# Altium project Audio Amplifier.PrjPcb
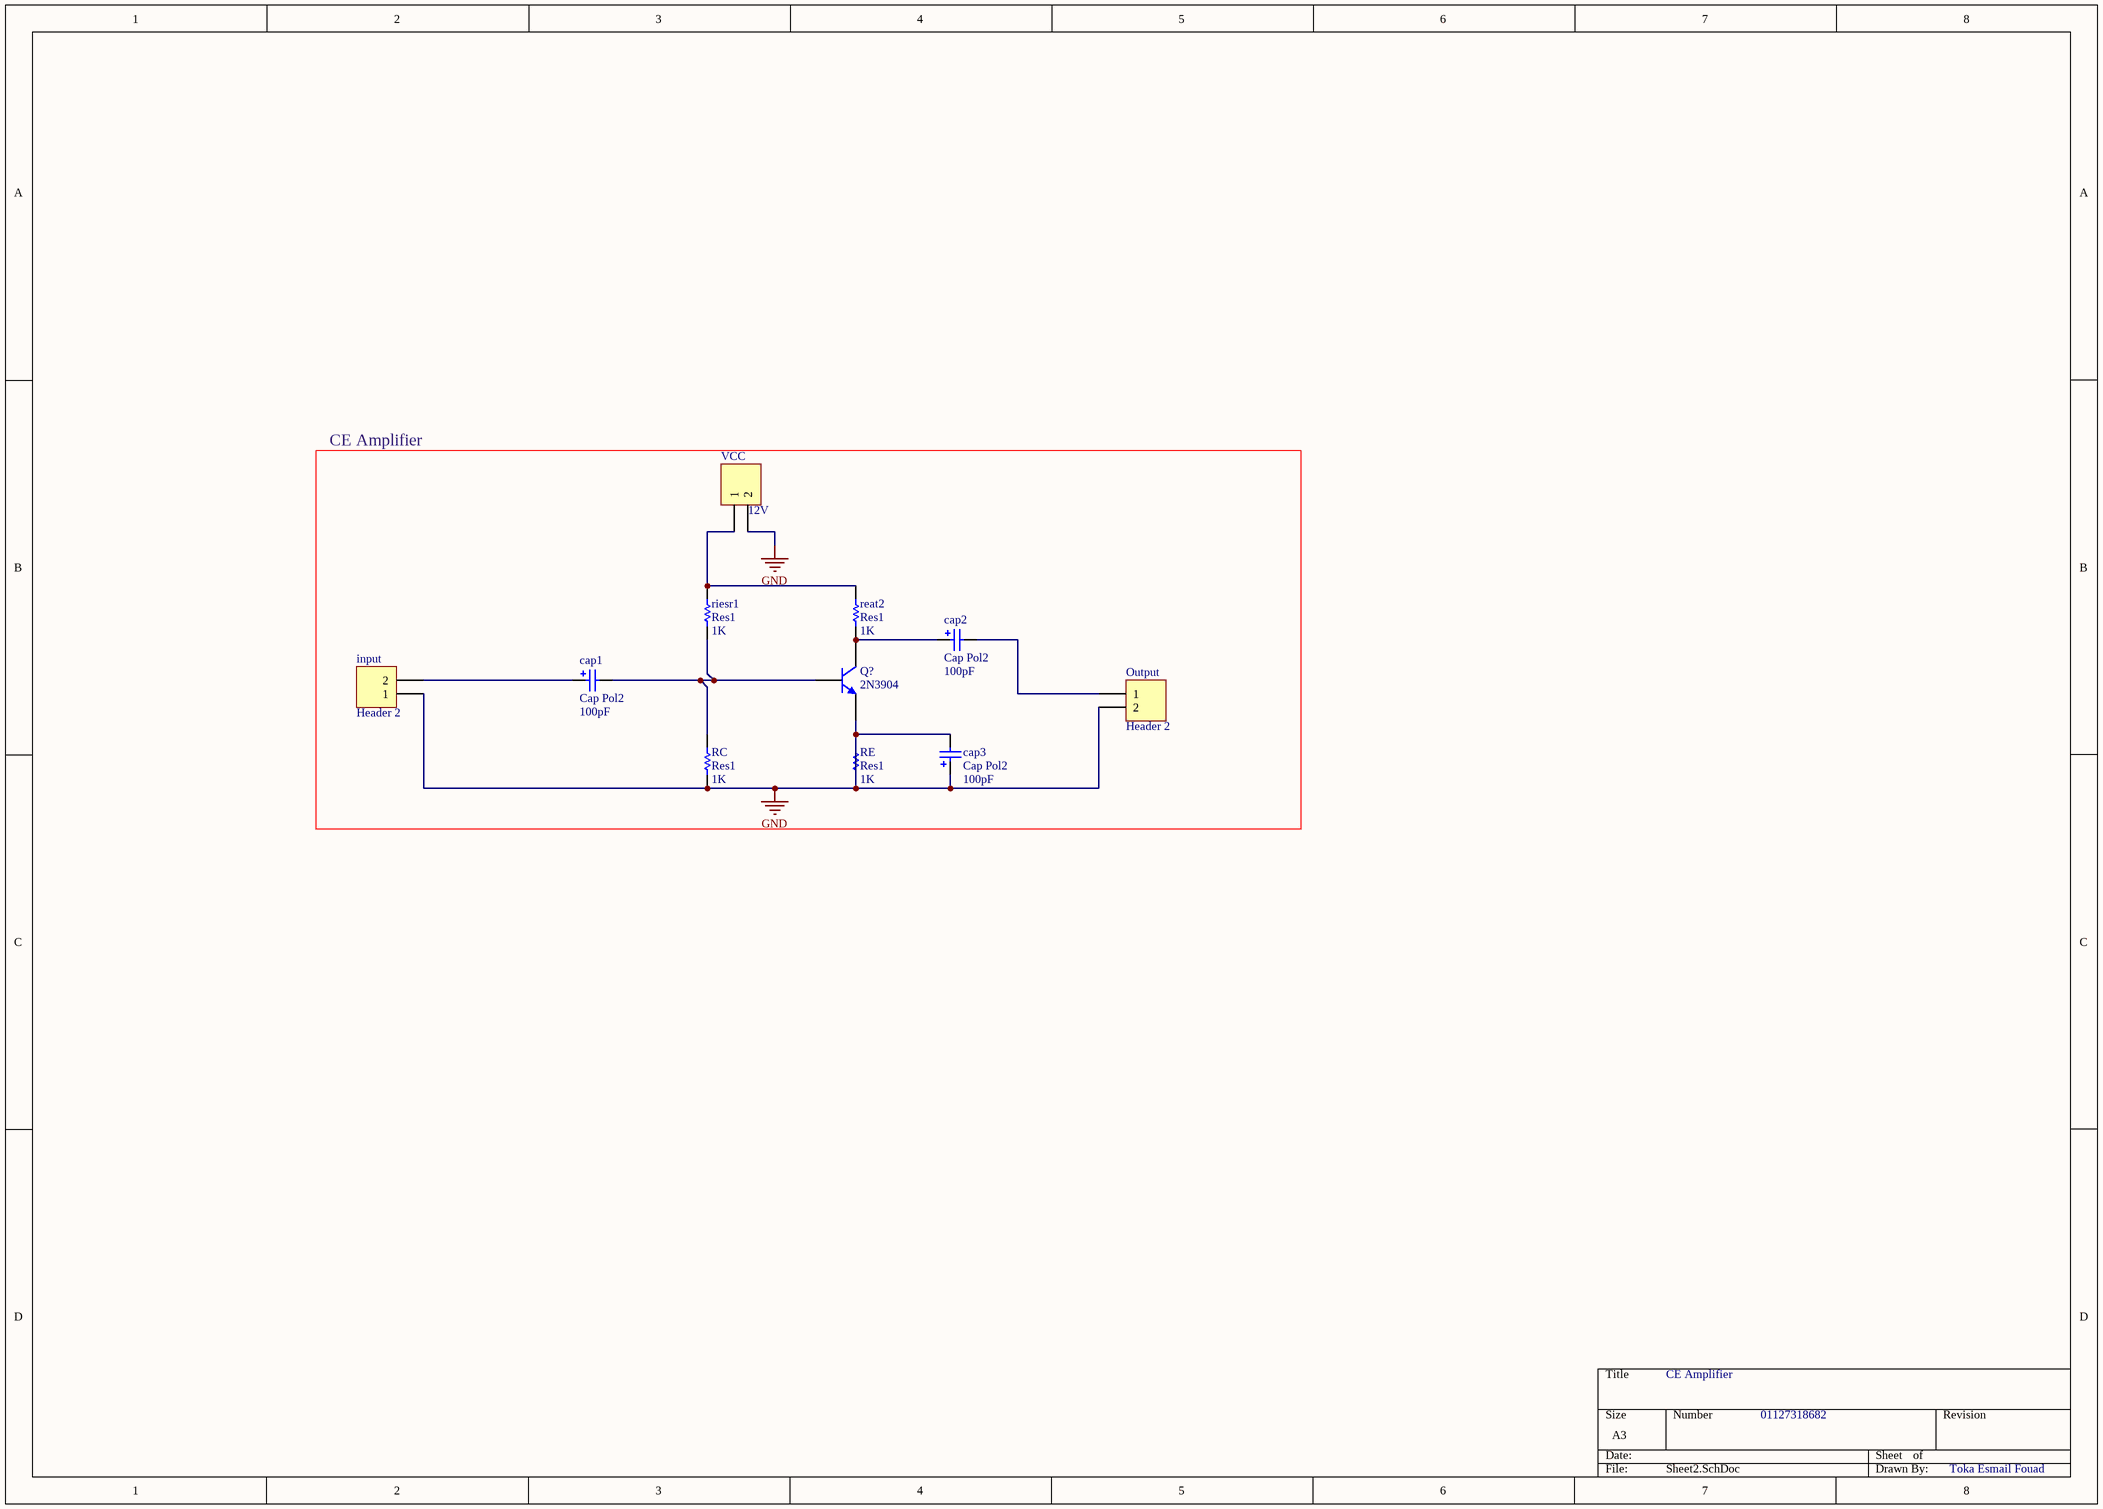
[diagram p0: Sheet2.SchDoc]
date: 5/8/2023; design: audio amplifier; designer: Toka esmail
1 sheet, 11 parts. Net scope: global (net labels, ports and power ports of the same name join across sheets).
Board file: PCB2.PcbDoc

## Sheet Sheet2.SchDoc
size A3; SheetNumber: 1; SheetTotal: 1; SPICEModelCacheNKUCFGHT: <root> / <DocumentId>NKUCFGHT</DocumentId> / <CacheFrame Number="0"> / <Model Name="cap" Kind="MDL"> / <Text>*Default semiconductor capacitor / .MODEL CAP C()</Text> / </Model> / <Model Name="2n3904" Kind="MDL"> / <Text>*2N3904 / *Si 310mW  40V 200mA 300MHz pkg:TO-92B 1,2,3 / .MODEL 2N3904 NPN(IS=1.4E-14 BF=300 VAF=100 IKF=0.025 ISE=3E-13 / + BR=7.5 RC=2.4 CJE=4.5E-12 TF=4E-10 CJC=3.5E-12 TR=2.1E-8 XTB=1.5 KF=9E-16 )</Text> / </Model> / </CacheFrame> / </root>

### Parts
cap1  Cap Pol2  value 100pF  [POLAR0.8]
cap2  Cap Pol2  value 100pF  [POLAR0.8]
cap3  Cap Pol2  value 100pF  [POLAR0.8]
input  Header 2  [HDR1X2]
Output  Header 2  [HDR1X2]
Q?  2N3904  [TO-92A]
RC  Res1  value 1K  [AXIAL-0.3]
RE  Res1  value 1K  [AXIAL-0.3]
reat2  Res1  value 1K  [AXIAL-0.3]
riesr1  Res1  value 1K  [AXIAL-0.3]
VCC  12V  [HDR1X2]

### Blocks framed on the sheet
CE Amplifier: cap1-cap3 input Output Q? RC RE reat2 riesr1 VCC

### Nets
GND: cap3.1 cap3.2 input.1 Output.2 Q?.1(E) RC.1 RE.1 RE.2 VCC.2
Netcap1_1: cap1.1 input.2
Netcap1_2: cap1.2 Q?.2(B) RC.2 riesr1.1
Netcap2_1: cap2.1 Q?.3(C) reat2.1
Netcap2_2: cap2.2 Output.1
Netreat2_2: reat2.2 riesr1.2 VCC.1

### Notes on the sheet
- CE Amplifier
- 01127318682
- Toka Esmail Fouad

### Library data of the parts
cap1-cap3 = Cap Pol2: Polarized Capacitor (Axial); Published: 8-Jun-2000; LatestRevisionDate: 17-Jul-2002; LatestRevisionNote: Re-released for DXP Platform.; PackageReference: POLAR0.8; Publisher: Altium Limited; PackageDescription: Polarized Capacitor; 2 Leads
input Output VCC = Header 2: Header, 2-Pin; LatestRevisionDate: 17-Jul-2002; LatestRevisionNote: Re-released for DXP Platform.; Publisher: Altium Limited
Q? = 2N3904: NPN General Purpose Amplifier; Published: 8-Jun-2000; LatestRevisionDate: 15-Jan-2003; LatestRevisionNote: PCB Footprint 'BCY-W3/D4.7' replaced; DatasheetVersion: 1997; PackageVersion: Sep-1998; PackageReference: TO-92A; Publisher: Altium Limited; PackageDescription: TO, Flat Index; 3 In-Line, Axial Leads; Body Dia. 4.5mm; Leads 0.51 x 0.48 mm (max); ComponentLink1Description: Manufacturer Link; ComponentLink1URL: http://www.fairchildsemi.com/; ComponentLink2Description: Datasheet; ComponentLink2URL: http://www.fairchildsemi.com/ds/2N%2F2N3904.pdf
RC RE reat2 riesr1 = Res1: Resistor; Published: 8-Jun-2000; LatestRevisionDate: 17-Jul-2002; LatestRevisionNote: Re-released for DXP Platform.; PackageReference: AXIAL-0.3; Publisher: Altium Limited; PackageDescription: Axial Device, Thru-Hole; 2 Leads; 0.3 in Pin Spacing